# EAGLE design circuit (EAGLE 7.6.0)
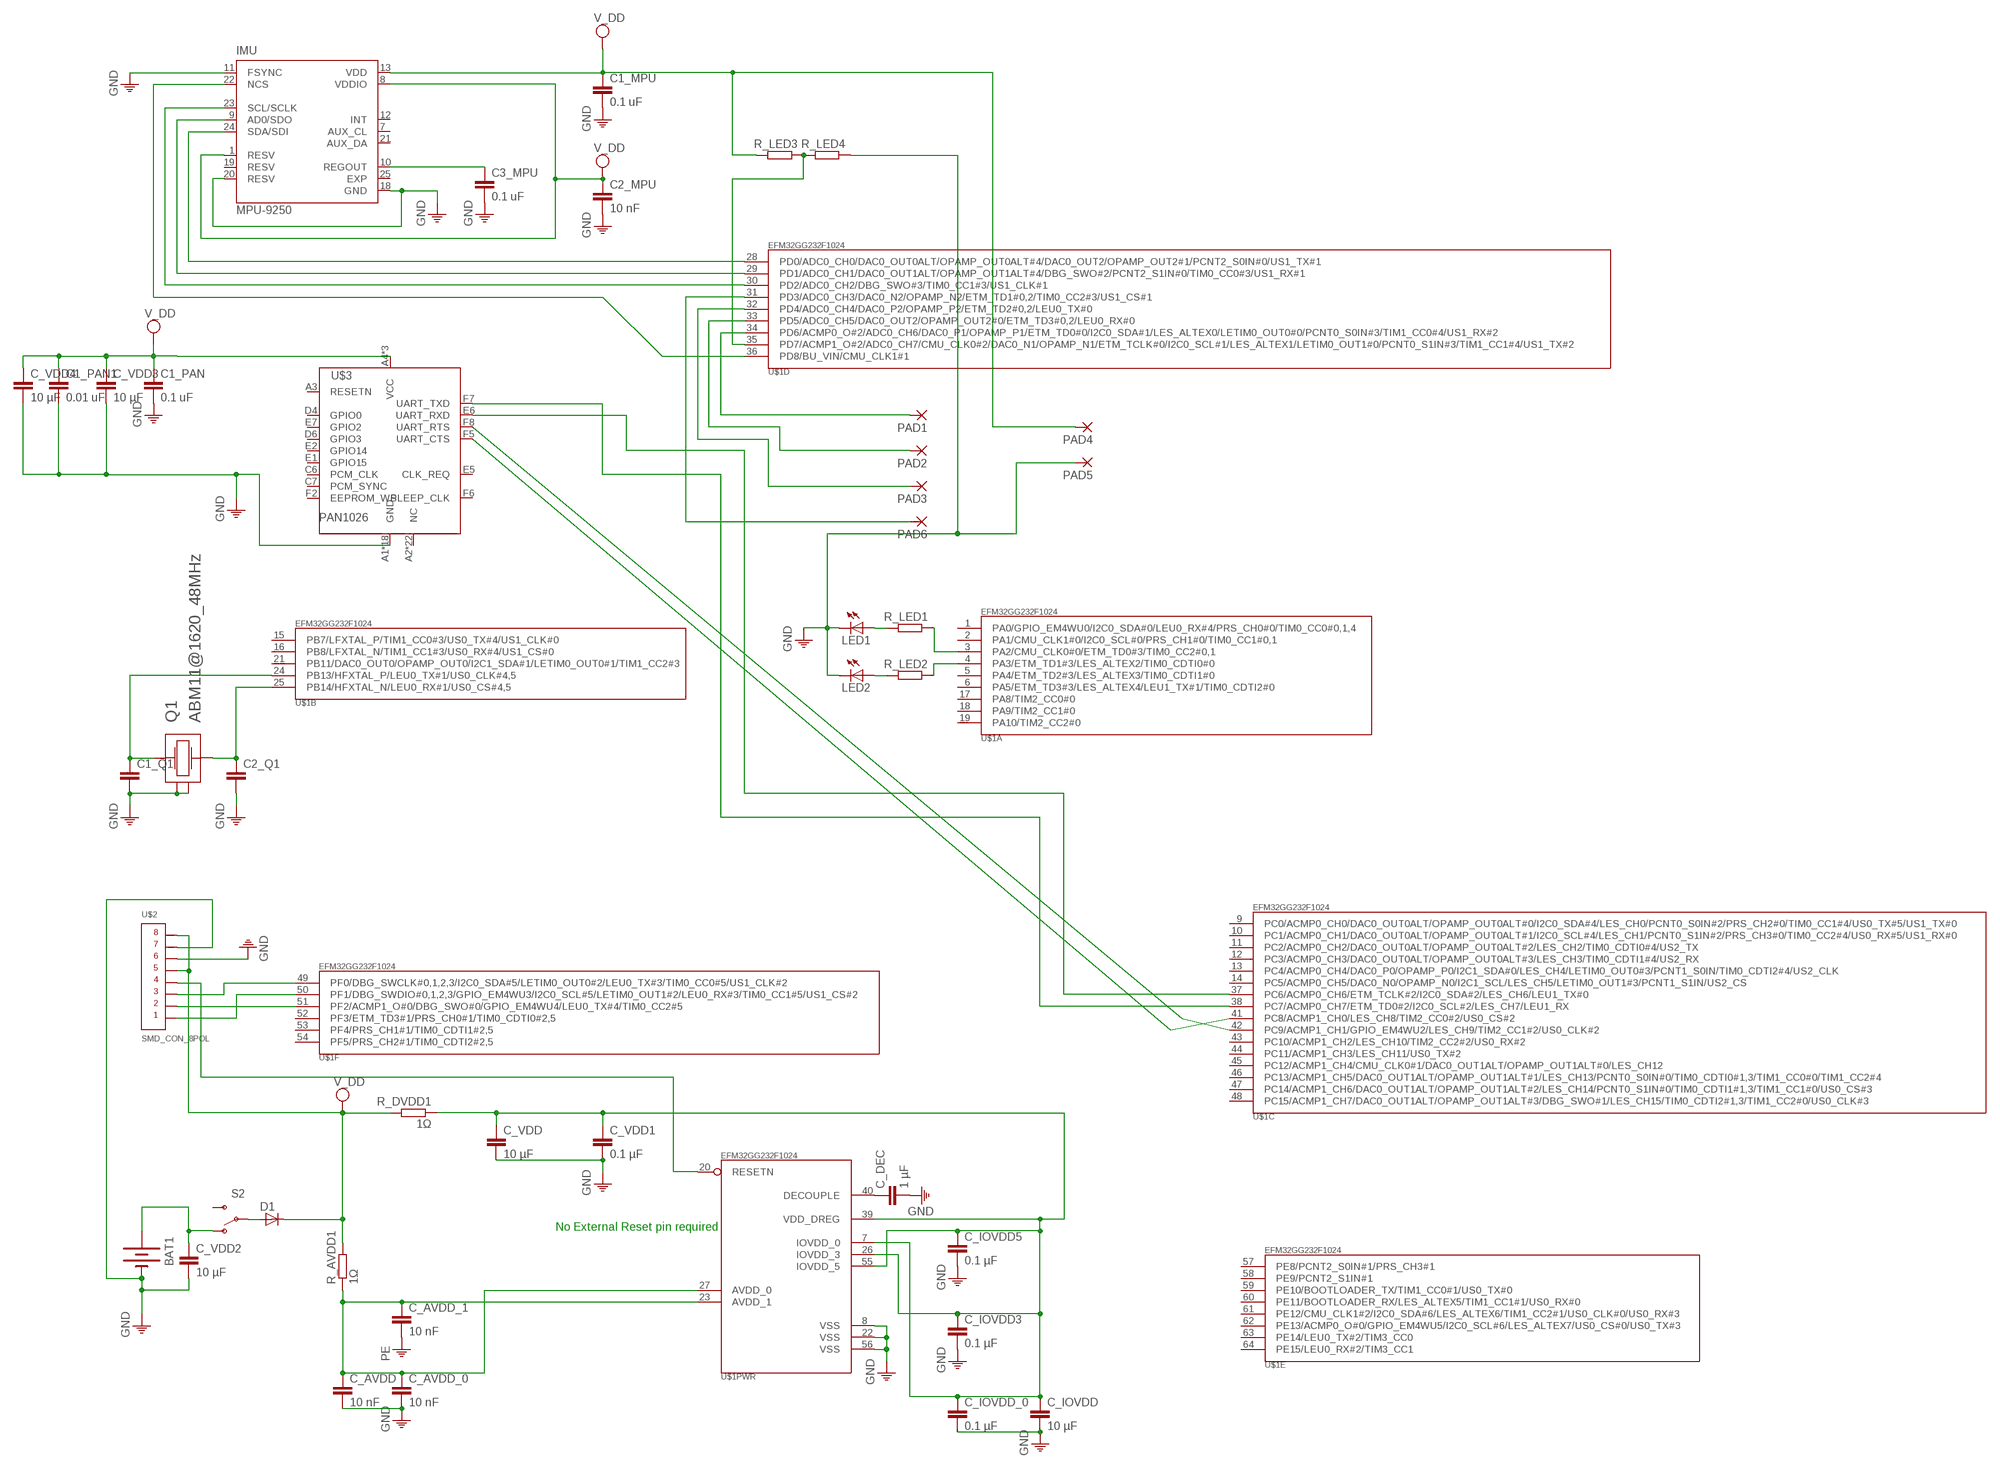
[diagram p0: schematic, sheet 1]

## Parts
BAT1  BATTERY20MM_4LEGS_OVERPASTE  [BATTCON_20MM_4LEGS_OVERPASTE]
C1_MPU  0.1 uF  C-EUC0603  [C0603]
C1_PAN  0.1 uF  C-EUC0603  [C0603]
C1_PAN1  0.01 uF  C-EUC0603  [C0603]
C1_Q1  C-EUC0603  [C0603]
C2_MPU  10 nF  C-EUC0603  [C0603]
C2_Q1  C-EUC0603  [C0603]
C3_MPU  0.1 uF  C-EUC0603  [C0603]
C_AVDD  10 nF  C-EUC0603  [C0603]
C_AVDD_0  10 nF  C-EUC0603  [C0603]
C_AVDD_1  10 nF  C-EUC0603  [C0603]
C_DEC  1 µF  C-EUC0603  [C0603]
C_IOVDD  10 µF  C-EUC0805  [C0805]
C_IOVDD3  0.1 µF  C-EUC0603  [C0603]
C_IOVDD5  0.1 µF  C-EUC0603  [C0603]
C_IOVDD_0  0.1 µF  C-EUC0603  [C0603]
C_VDD  10 µF  C-EUC0805  [C0805]
C_VDD1  0.1 µF  C-EUC0603  [C0603]
C_VDD2  10 µF  C-EUC0805  [C0805]
C_VDD3  10 µF  C-EUC0805  [C0805]
C_VDD4  10 µF  C-EUC0805  [C0805]
D1  D-SOD123  [SOD123]
IMU  MPU-9250  [QFN40P300X300X105-25N]
LED1  LEDCHIPLED_0805  [CHIPLED_0805]
LED2  LEDCHIPLED_0805  [CHIPLED_0805]
PAD1  SMD2  [SMD1,27-2,54]
PAD2  SMD2  [SMD1,27-2,54]
PAD3  SMD2  [SMD1,27-2,54]
PAD4  SMD2  [SMD1,27-2,54]
PAD5  SMD2  [SMD1,27-2,54]
PAD6  SMD2  [SMD1,27-2,54]
Q1  ABM11@1620_48MHz  ABM11@1620  [1620]
R_AVDD1  1Ω  R-EU_R0603  [R0603]
R_DVDD1  1Ω  R-EU_R0603  [R0603]
R_LED1  R-EU_R0603  [R0603]
R_LED2  R-EU_R0603  [R0603]
R_LED3  R-EU_R0603  [R0603]
R_LED4  R-EU_R0603  [R0603]
S2  SWITCH-SPDTSMD2  [SWITCH-SPDT-SMD]
U$1  EFM32GG232F1024  [QFP64]
U$2  SMD_CON_8POL  [SMD_CON_8POL]
U$3  PAN1026  [PAN1026]

## Nets
GND: BAT1.2(-) C1_MPU.2 C1_PAN1.2 C1_PAN.2 C1_Q1.2 C2_MPU.2 C2_Q1.2 C3_MPU.2 C_AVDD.2 C_AVDD_0.2 C_AVDD_1.2 C_DEC.2 C_IOVDD3.2 C_IOVDD5.2 C_IOVDD.2 C_IOVDD_0.2 C_VDD1.2 C_VDD2.2 C_VDD3.2 C_VDD4.2 C_VDD.2 IMU.11(FSYNC) IMU.18(GND) IMU.20(RESV) LED1.C LED2.C PAD5.1(P) Q1.P$2 Q1.P$4 R_LED4.1 U$1.8(PWR:VSS) U$1.22(PWR:VSS) U$1.56(PWR:VSS) U$2.P$6 U$2.P$7 U$3.A1(GND) U$3.A7(GND) U$3.A9(GND) U$3.A11(GND) U$3.A12(GND) U$3.C8(GND) U$3.C9(GND) U$3.D7(GND) U$3.D8(GND) U$3.E3(GND) U$3.E8(GND) U$3.E9(GND) U$3.F1(GND) U$3.F3(GND) U$3.F4(GND) U$3.F9(GND) U$3.F11(GND) U$3.F12(GND) ; supply symbol labelled PE
N$1: C_DEC.1 U$1.40(PWR:DECOUPLE)
N$2: C_IOVDD3.1 C_IOVDD5.1 C_IOVDD.1 C_IOVDD_0.1 C_VDD1.1 C_VDD.1 R_DVDD1.1 U$1.7(PWR:IOVDD_0) U$1.26(PWR:IOVDD_3) U$1.39(PWR:VDD_DREG) U$1.55(PWR:IOVDD_5)
N$3: PAD3.1(P) U$1.32(D:PD4/ADC0_CH4/DAC0_P2/OPAMP_P2/ETM_TD2#0,2/LEU0_TX#0)
N$4: C2_Q1.1 Q1.P$1 U$1.25(B:PB14/HFXTAL_N/LEU0_RX#1/US0_CS#4,5)
N$5: C_AVDD.1 C_AVDD_0.1 C_AVDD_1.1 R_AVDD1.1 U$1.23(PWR:AVDD_1) U$1.27(PWR:AVDD_0)
N$6: BAT1.1(+) C_VDD2.1 S2.1(O)
N$7: PAD2.1(P) U$1.33(D:PD5/ADC0_CH5/DAC0_OUT2/OPAMP_OUT2#0/ETM_TD3#0,2/LEU0_RX#0)
N$8: C1_Q1.1 Q1.P$3 U$1.24(B:PB13/HFXTAL_P/LEU0_TX#1/US0_CLK#4,5)
N$9: U$1.50(F:PF1/DBG_SWDIO#0,1,2,3/GPIO_EM4WU3/I2C0_SCL#5/LETIM0_OUT1#2/LEU0_RX#3/TIM0_CC1#5/US1_CS#2) U$2.P$1
N$10: U$1.51(F:PF2/ACMP1_O#0/DBG_SWO#0/GPIO_EM4WU4/LEU0_TX#4/TIM0_CC2#5) U$2.P$2
N$11: D1.2(A) S2.2(P)
N$12: U$1.20(PWR:RESETN) U$2.P$4
N$13: IMU.22(NCS) U$1.36(D:PD8/BU_VIN/CMU_CLK1#1)
N$14: IMU.23(SCL/SCLK) U$1.30(D:PD2/ADC0_CH2/DBG_SWO#3/TIM0_CC1#3/US1_CLK#1)
N$15: IMU.9(AD0/SDO) U$1.29(D:PD1/ADC0_CH1/DAC0_OUT1ALT/OPAMP_OUT1ALT#4/DBG_SWO#2/PCNT2_S1IN#0/TIM0_CC0#3/US1_RX#1)
N$16: IMU.24(SDA/SDI) U$1.28(D:PD0/ADC0_CH0/DAC0_OUT0ALT/OPAMP_OUT0ALT#4/DAC0_OUT2/OPAMP_OUT2#1/PCNT2_S0IN#0/US1_TX#1)
N$17: C3_MPU.1 IMU.10(REGOUT)
N$18: LED1.A R_LED1.2
N$19: LED2.A R_LED2.2
N$20: R_LED1.1 U$1.3(A:PA2/CMU_CLK0#0/ETM_TD0#3/TIM0_CC2#0,1)
N$21: R_LED2.1 U$1.4(A:PA3/ETM_TD1#3/LES_ALTEX2/TIM0_CDTI0#0)
N$22: PAD1.1(P) U$1.34(D:PD6/ACMP0_O#2/ADC0_CH6/DAC0_P1/OPAMP_P1/ETM_TD0#0/I2C0_SDA#1/LES_ALTEX0/LETIM0_OUT0#0/PCNT0_S0IN#3/TIM1_CC0#4/US1_RX#2)
N$23: PAD6.1(P) U$1.31(D:PD3/ADC0_CH3/DAC0_N2/OPAMP_N2/ETM_TD1#0,2/TIM0_CC2#3/US1_CS#1)
N$25: U$1.37(C:PC6/ACMP0_CH6/ETM_TCLK#2/I2C0_SDA#2/LES_CH6/LEU1_TX#0) U$3.E6(UART_RXD)
N$26: U$1.38(C:PC7/ACMP0_CH7/ETM_TD0#2/I2C0_SCL#2/LES_CH7/LEU1_RX) U$3.F7(UART_TXD)
N$27: U$1.49(F:PF0/DBG_SWCLK#0,1,2,3/I2C0_SDA#5/LETIM0_OUT0#2/LEU0_TX#3/TIM0_CC0#5/US1_CLK#2) U$2.P$3
N$28: R_LED3.1 R_LED4.2 U$1.35(D:PD7/ACMP1_O#2/ADC0_CH7/CMU_CLK0#2/DAC0_N1/OPAMP_N1/ETM_TCLK#0/I2C0_SCL#1/LES_ALTEX1/LETIM0_OUT1#0/PCNT0_S1IN#3/TIM1_CC1#4/US1_TX#2)
N$29: U$1.42(C:PC9/ACMP1_CH1/GPIO_EM4WU2/LES_CH9/TIM2_CC1#2/US0_CLK#2) U$3.F8(UART_RTS)
N$30: U$1.41(C:PC8/ACMP1_CH0/LES_CH8/TIM2_CC0#2/US0_CS#2) U$3.F5(UART_CTS)
VDD: C1_MPU.1 C1_PAN1.1 C1_PAN.1 C2_MPU.1 C_VDD3.1 C_VDD4.1 D1.1(C) IMU.1(RESV) IMU.8(VDDIO) IMU.13(VDD) PAD4.1(P) R_AVDD1.2 R_DVDD1.2 R_LED3.2 U$2.P$5 U$2.P$8 U$3.A4(VCC) U$3.A5(VCC) U$3.A6(VCC) ; supply symbol labelled V_DD
Unconnected: IMU.7(AUX_CL) IMU.12(INT) IMU.21(AUX_DA) S2.3(S) U$1.1(A:PA0/GPIO_EM4WU0/I2C0_SDA#0/LEU0_RX#4/PRS_CH0#0/TIM0_CC0#0,1,4) U$1.2(A:PA1/CMU_CLK1#0/I2C0_SCL#0/PRS_CH1#0/TIM0_CC1#0,1) U$1.5(A:PA4/ETM_TD2#3/LES_ALTEX3/TIM0_CDTI1#0) U$1.6(A:PA5/ETM_TD3#3/LES_ALTEX4/LEU1_TX#1/TIM0_CDTI2#0) U$1.9(C:PC0/ACMP0_CH0/DAC0_OUT0ALT/OPAMP_OUT0ALT#0/I2C0_SDA#4/LES_CH0/PCNT0_S0IN#2/PRS_CH2#0/TIM0_CC1#4/US0_TX#5/US1_TX#0) U$1.10(C:PC1/ACMP0_CH1/DAC0_OUT0ALT/OPAMP_OUT0ALT#1/I2C0_SCL#4/LES_CH1/PCNT0_S1IN#2/PRS_CH3#0/TIM0_CC2#4/US0_RX#5/US1_RX#0) U$1.11(C:PC2/ACMP0_CH2/DAC0_OUT0ALT/OPAMP_OUT0ALT#2/LES_CH2/TIM0_CDTI0#4/US2_TX) U$1.12(C:PC3/ACMP0_CH3/DAC0_OUT0ALT/OPAMP_OUT0ALT#3/LES_CH3/TIM0_CDTI1#4/US2_RX) U$1.13(C:PC4/ACMP0_CH4/DAC0_P0/OPAMP_P0/I2C1_SDA#0/LES_CH4/LETIM0_OUT0#3/PCNT1_S0IN/TIM0_CDTI2#4/US2_CLK) U$1.14(C:PC5/ACMP0_CH5/DAC0_N0/OPAMP_N0/I2C1_SCL/LES_CH5/LETIM0_OUT1#3/PCNT1_S1IN/US2_CS) U$1.15(B:PB7/LFXTAL_P/TIM1_CC0#3/US0_TX#4/US1_CLK#0) U$1.16(B:PB8/LFXTAL_N/TIM1_CC1#3/US0_RX#4/US1_CS#0) U$1.17(A:PA8/TIM2_CC0#0) U$1.18(A:PA9/TIM2_CC1#0) U$1.19(A:PA10/TIM2_CC2#0) U$1.21(B:PB11/DAC0_OUT0/OPAMP_OUT0/I2C1_SDA#1/LETIM0_OUT0#1/TIM1_CC2#3) U$1.43(C:PC10/ACMP1_CH2/LES_CH10/TIM2_CC2#2/US0_RX#2) U$1.44(C:PC11/ACMP1_CH3/LES_CH11/US0_TX#2) U$1.45(C:PC12/ACMP1_CH4/CMU_CLK0#1/DAC0_OUT1ALT/OPAMP_OUT1ALT#0/LES_CH12) U$1.46(C:PC13/ACMP1_CH5/DAC0_OUT1ALT/OPAMP_OUT1ALT#1/LES_CH13/PCNT0_S0IN#0/TIM0_CDTI0#1,3/TIM1_CC0#0/TIM1_CC2#4) U$1.47(C:PC14/ACMP1_CH6/DAC0_OUT1ALT/OPAMP_OUT1ALT#2/LES_CH14/PCNT0_S1IN#0/TIM0_CDTI1#1,3/TIM1_CC1#0/US0_CS#3) U$1.48(C:PC15/ACMP1_CH7/DAC0_OUT1ALT/OPAMP_OUT1ALT#3/DBG_SWO#1/LES_CH15/TIM0_CDTI2#1,3/TIM1_CC2#0/US0_CLK#3) U$1.52(F:PF3/ETM_TD3#1/PRS_CH0#1/TIM0_CDTI0#2,5) U$1.53(F:PF4/PRS_CH1#1/TIM0_CDTI1#2,5) U$1.54(F:PF5/PRS_CH2#1/TIM0_CDTI2#2,5) U$1.57(E:PE8/PCNT2_S0IN#1/PRS_CH3#1) U$1.58(E:PE9/PCNT2_S1IN#1) U$1.59(E:PE10/BOOTLOADER_TX/TIM1_CC0#1/US0_TX#0) U$1.60(E:PE11/BOOTLOADER_RX/LES_ALTEX5/TIM1_CC1#1/US0_RX#0) U$1.61(E:PE12/CMU_CLK1#2/I2C0_SDA#6/LES_ALTEX6/TIM1_CC2#1/US0_CLK#0/US0_RX#3) U$1.62(E:PE13/ACMP0_O#0/GPIO_EM4WU5/I2C0_SCL#6/LES_ALTEX7/US0_CS#0/US0_TX#3) U$1.63(E:PE14/LEU0_TX#2/TIM3_CC0) U$1.64(E:PE15/LEU0_RX#2/TIM3_CC1) U$3.A2(NC) U$3.A3(RESETN) U$3.A8(NC) U$3.B1(NC) U$3.B2(NC) U$3.B3(NC) U$3.B4(NC) U$3.B5(NC) U$3.B6(NC) U$3.B7(NC) U$3.B8(NC) U$3.B9(NC) U$3.C1(NC) U$3.C2(NC) U$3.C3(NC) U$3.C4(NC) U$3.C5(NC) U$3.C6(PCM_CLK) U$3.C7(PCM_SYNC) U$3.D1(NC) U$3.D2(NC) U$3.D3(NC) U$3.D4(GPIO0) U$3.D5(NC) U$3.D6(GPIO3) U$3.D9(NC) U$3.E1(GPIO15) U$3.E2(GPIO14) U$3.E4(NC) U$3.E5(CLK_REQ) U$3.E7(GPIO2) U$3.F2(EEPROM_WP) U$3.F6(SLEEP_CLK)

## Notes on the sheet
- No External Reset pin required

## Power pins joined to a net without a drawn wire
EXP: IMU.25(EXP)
RESV: IMU.19(RESV)

## Library data of the parts
BAT1 = SparkFun-Electromechanical:BATTERY: Battery Holders Various common sizes : AA, AAA, 18650 (PRT-12895), 20mm coin cell and 12mm coin cell. 20MM_4LEGS, BATT-10373
C1_MPU C1_PAN C1_PAN1 C1_Q1 C2_MPU C2_Q1 C3_MPU C_AVDD C_AVDD_0 C_AVDD_1 C_DEC C_IOVDD C_IOVDD3 C_IOVDD5 C_IOVDD_0 C_VDD C_VDD1-C_VDD4 = rcl:C-EU: CAPACITOR, European symbol; OC_FARNELL: unknown
D1 = semicon-smd-ipc:D-: DIODE unfilled
IMU = MPU-9250:MPU-9250: GYRO/ACCEL/COMPASS/9-AXIS; OC_FARNELL: unknown
LED1 LED2 = led:LED: LED OSRAM: - CHIPLED LG R971, LG N971, LY N971, LG Q971, LY Q971, LO R971, LY R971 LH N974, LH R974 LS Q976, LO Q976, LY Q976 LO Q996 - Hyper CHIPLED LW Q18S LB Q993, LB Q99A, LB R99A - SideLED LS A670, LO A670, LY A670, LG A670, LP A670 LB A673, LV A673, LT A673, LW A673 LH A674 LY A675 LS A676, LA A676, LO A676, LY A676, LW A676 LS A679, LY A679, LG A679 - Hyper Micro SIDELED® LS Y876, LA Y876, LO Y876, LY Y876 LT Y87S - SmartLED LW L88C, LW L88S LB L89C, LB L89S, LG L890 LS L89K, LO L89K, LY L89K LS L896, LA L896, LO L896, LY L896 - TOPLED LS T670, LO T670, LY T670, LG T670, LP T670 LSG T670, LSP T670, LSY T670, LOP T670, LYG T670 LG T671, LOG T671, LSG T671 LB T673, LV T673, LT T673, LW T673 LH T674 LS T676, LA T676, LO T676, LY T676, LB T676, LH T676, LSB T676, LW T676 LB T67C, LV T67C, LT T67C, LS T67K, LO T67K, LY T67K, LW E67C LS E67B, LA E67B, LO E67B, LY E67B, LB E67C, LV E67C, LT E67C LW T67C LS T679, LY T679, LG T679 LS T770, LO T770, LY T770, LG T770, LP T770 LB T773, LV T773, LT T773, LW T773 LH T774 LS E675, LA E675, LY E675, LS T675 LS T776, LA T776, LO T776, LY T776, LB T776 LHGB T686 LT T68C, LB T68C - Hyper Mini TOPLED® LB M676 - Mini TOPLED Santana® LG M470 LS M47K, LO M47K, LY M47K Source: http://www.osram.convergy.de LUXEON: - LUMILED® LXK2-PW12-R00, LXK2-PW12-S00, LXK2-PW14-U00, LXK2-PW14-V00 LXK2-PM12-R00, LXK2-PM12-S00, LXK2-PM14-U00 LXK2-PE12-Q00, LXK2-PE12-R00, LXK2-PE12-S00, LXK2-PE14-T00, LXK2-PE14-U00 LXK2-PB12-K00, LXK2-PB12-L00, LXK2-PB12-M00, LXK2-PB14-N00, LXK2-PB14-P00, LXK2-PB14-Q00 LXK2-PR12-L00, LXK2-PR12-M00, LXK2-PR14-Q00, LXK2-PR14-R00 LXK2-PD12-Q00, LXK2-PD12-R00, LXK2-PD12-S00 LXK2-PH12-R00, LXK2-PH12-S00 LXK2-PL12-P00, LXK2-PL12-Q00, LXK2-PL12-R00 Source: www.luxeon.com KINGBRIGHT: KA-3528ASYC Source: www.kingbright.com; OC_FARNELL: unknown
PAD1-PAD6 = wirepad:SMD2: SMD PAD
Q1 = crystals:ABM11
R_AVDD1 R_DVDD1 R_LED1-R_LED4 = rcl:R-EU_: RESISTOR, European symbol; OC_FARNELL: unknown
S2 = SparkFun-Electromechanical:SWITCH-SPDT: SPDT Switch Simple slide switch, Spark Fun Electronics SKU : COM-00102 DPDT SMT slide switch, AYZ0202, SWCH-08179
U$1 = EnergyMicro:EFM32GG232F1024: EFM32GG232F1024 Gecko Microcontroller in 10mm x 10mm QFP64 package; OC_FARNELL: unknown
U$2 = con-microsmd:SMD_CON_8POL
U$3 = asl_bluetooth_module:PAN1026

## Board
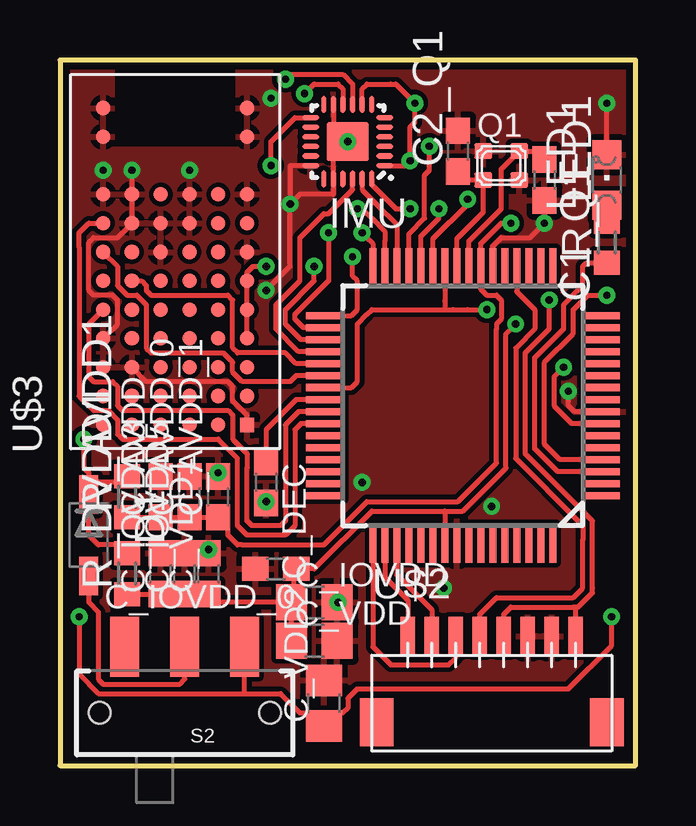
[diagram p1: board, top side]
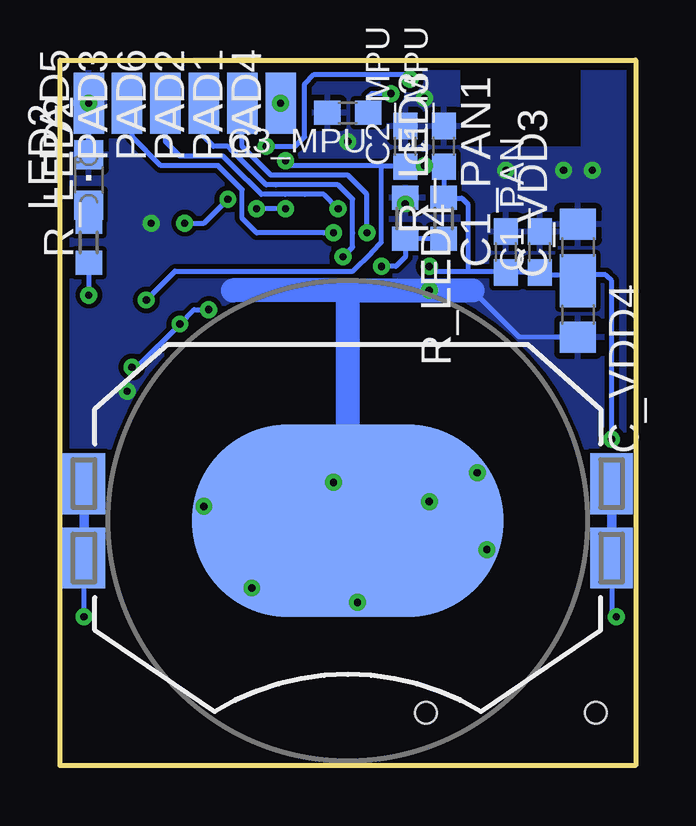
[diagram p2: board, bottom side, seen from below]

Size 24 x 29.4 mm. Coordinates in mm from the lower left corner, seen from the top.
Outline: 0,0 24,0 24,29.4 0,29.4 0,0
Copper layers (1*16): Top 0.035mm / dielectric 1.5mm / Bottom 0.035mm
Design rules "default *": minimum track width 0.2mm, minimum drill 0.3mm, track to track 0.2mm, track to pad 0.2mm, pad to pad 0.2mm, via to via 0.2mm, smd to smd 0mil, copper to edge 0.3mm, drill to drill 0.5mm, minimum pad ring 10mil, minimum via ring 8mil, stop-mask expansion 4mil, vias tented up to drill 0mil, thermal gap 10mil
tKeepout: area 2.3,25.8 to 7.3,28.8; area 2.3,26.2 to 7.3,29.2
bKeepout: area 2.3,25.8 to 7.3,28.8; area 2.3,26.2 to 7.3,29.2
tRestrict: area 2.3,25.8 to 7.3,28.8; area 2.3,26.2 to 7.3,29.2
bRestrict: area 2.3,26.2 to 7.3,29.2; area 2.3,25.8 to 7.3,28.8

### Footprints (pad centres in the part's own frame; a part is rotated, then mirrored left to right if it is on the bottom)
BATTCON_20MM_4LEGS_OVERPASTE = smd 1.778 x 2.54: 1 -11,1.55; 3 11,1.55; P$1 -11,-1.55; P$2 11,-1.55 | smd 13 x 8: 2 0,0
C0603 = smd 1.1 x 1: 1 -0.85,0; 2 0.85,0
C0805 = smd 1.3 x 1.5: 1 -0.95,0; 2 0.95,0
SOD123 = smd 1.6 x 0.8: 1 -1.7,0; 2 1.7,0
QFN40P300X300X105-25N = smd 0.7 x 0.2: 1 -1.55,1; 2 -1.55,0.6; 3 -1.55,0.2; 4 -1.55,-0.2; 5 -1.55,-0.6; 6 -1.55,-1; 13 1.55,-1; 14 1.55,-0.6; 15 1.55,-0.2; 16 1.55,0.2; 17 1.55,0.6; 18 1.55,1 | smd 0.2 x 0.7: 7 -1,-1.55; 8 -0.6,-1.55; 9 -0.2,-1.55; 10 0.2,-1.55; 11 0.6,-1.55; 12 1,-1.55; 19 1,1.55; 20 0.6,1.55; 21 0.2,1.55; 22 -0.2,1.55; 23 -0.6,1.55; 24 -1,1.55 | smd 1.75 x 1.6: 25 0,0
CHIPLED_0805 = smd 1.2 x 1.2: A 0,-1.05; C 0,1.05
SMD1,27-2,54 = smd 1.27 x 2.54: 1 0,0
1620 = smd 0.75 x 0.65: P$1 -0.75,-0.6; P$2 0.75,-0.6; P$3 0.75,0.6; P$4 -0.75,0.6
R0603 = smd 1 x 1.1: 1 -0.85,0; 2 0.85,0
SWITCH-SPDT-SMD = smd 1.2 x 2.5: 1 -2.5,-2.75; 2 0,-2.75; 3 2.5,-2.75 | hole 0.9: -3.55,0; 3.55,0
QFP64 = smd 1.6 x 0.3: 1 -5.75,3.75; 2 -5.75,3.25; 3 -5.75,2.75; 4 -5.75,2.25; 5 -5.75,1.75; 6 -5.75,1.25; 7 -5.75,0.75; 8 -5.75,0.25; 9 -5.75,-0.25; 10 -5.75,-0.75; 11 -5.75,-1.25; 12 -5.75,-1.75; 13 -5.75,-2.25; 14 -5.75,-2.75; 15 -5.75,-3.25; 16 -5.75,-3.75; 33 5.75,-3.75; 34 5.75,-3.25; 35 5.75,-2.75; 36 5.75,-2.25; 37 5.75,-1.75; 38 5.75,-1.25; 39 5.75,-0.75; 40 5.75,-0.25; 41 5.75,0.25; 42 5.75,0.75; 43 5.75,1.25; 44 5.75,1.75; 45 5.75,2.25; 46 5.75,2.75; 47 5.75,3.25; 48 5.75,3.75 | smd 0.3 x 1.6: 17 -3.75,-5.75; 18 -3.25,-5.75; 19 -2.75,-5.75; 20 -2.25,-5.75; 21 -1.75,-5.75; 22 -1.25,-5.75; 23 -0.75,-5.75; 24 -0.25,-5.75; 25 0.25,-5.75; 26 0.75,-5.75; 27 1.25,-5.75; 28 1.75,-5.75; 29 2.25,-5.75; 30 2.75,-5.75; 31 3.25,-5.75; 32 3.75,-5.75; 49 3.75,5.75; 50 3.25,5.75; 51 2.75,5.75; 52 2.25,5.75; 53 1.75,5.75; 54 1.25,5.75; 55 0.75,5.75; 56 0.25,5.75; 57 -0.25,5.75; 58 -0.75,5.75; 59 -1.25,5.75; 60 -1.75,5.75; 61 -2.25,5.75; 62 -2.75,5.75; 63 -3.25,5.75; 64 -3.75,5.75
SMD_CON_8POL = smd 0.6 x 1.6: P$1 1.5,4.8; P$2 2.5,4.8; P$3 3.5,4.8; P$4 4.5,4.8; P$5 5.5,4.8; P$6 6.5,4.8; P$7 7.5,4.8; P$8 8.5,4.8 | smd 1.4 x 2: P$9 0.2,1.2; P$10 9.8,1.2
PAN1026 = smd 0.6 x 0.6: A1 -6.8,-3; A2 -5.6,-3; A3 -4.4,-3; A4 -3.2,-3; A5 -2,-3; A6 -0.8,-3; A7 0.4,-3; A8 1.6,-3; A9 2.8,-3; A11 5.2,-3; A12 6.4,-3; B1 -6.8,-1.8; B2 -5.6,-1.8; B3 -4.4,-1.8; B4 -3.2,-1.8; B5 -2,-1.8; B6 -0.8,-1.8; B7 0.4,-1.8; B8 1.6,-1.8; B9 2.8,-1.8; C1 -6.8,-0.6; C2 -5.6,-0.6; C3 -4.4,-0.6; C4 -3.2,-0.6; C5 -2,-0.6; C6 -0.8,-0.6; C7 0.4,-0.6; C8 1.6,-0.6; C9 2.8,-0.6; D1 -6.8,0.6; D2 -5.6,0.6; D3 -4.4,0.6; D4 -3.2,0.6; D5 -2,0.6; D6 -0.8,0.6; D7 0.4,0.6; D8 1.6,0.6; D9 2.8,0.6; E1 -6.8,1.8; E2 -5.6,1.8; E3 -4.4,1.8; E4 -3.2,1.8; E5 -2,1.8; E6 -0.8,1.8; E7 0.4,1.8; E8 1.6,1.8; E9 2.8,1.8; F1 -6.8,3; F2 -5.6,3; F3 -4.4,3; F4 -3.2,3; F5 -2,3; F6 -0.8,3; F7 0.4,3; F8 1.6,3; F9 2.8,3; F11 5.2,3; F12 6.4,3

### Placement (x,y rotation side)
BAT1  12,10.2 0 bottom
C1_MPU  8,25.8 90 bottom
C1_PAN  4,21.4 90 bottom
C1_PAN1  5.4,21.4 90 bottom
C1_Q1  20.2,24.4 270 top
C2_MPU  9.6,25.8 90 bottom
C2_Q1  16.6,25.6 90 top
C3_MPU  12,27.2 180 bottom
C_AVDD  4.2,11.2 90 top
C_AVDD_0  5.4,11.2 90 top
C_AVDD_1  6.6,11.2 90 top
C_DEC  8.6,11.8 270 top
C_IOVDD  10.6,6.8 0 top
C_IOVDD3  4.2,8 90 top
C_IOVDD5  5.2,8 90 top
C_IOVDD_0  9,8.2 180 top
C_VDD  10.6,5.2 0 top
C_VDD1  6.2,8 90 top
C_VDD2  11,2.6 90 top
C_VDD3  2.4,21.6 90 bottom
C_VDD4  2.4,18.8 270 bottom
D1  1.2,9.6 270 top
IMU  12,26 180 top
LED1  22.8,24.4 0 top
LED2  22.8,24.4 0 bottom
PAD1  16.4,27.6 0 bottom
PAD2  18,27.6 0 bottom
PAD3  21.2,27.6 0 bottom
PAD4  14.8,27.6 0 bottom
PAD5  22.8,27.6 0 bottom
PAD6  19.6,27.6 0 bottom
Q1  18.4,25 0 top
R_AVDD1  2.8,11.2 90 top
R_DVDD1  2.8,8 90 top
R_LED1  22.8,21.8 90 top
R_LED2  22.8,21.8 90 bottom
R_LED3  8,22.8 90 bottom
R_LED4  9.6,22.8 270 bottom
S2  5.2,2.2 180 top
U$1  16.8,15 180 top
U$2  13,0.6 0 top
U$3  4.8,21 90 top

### Tracks (layer width: path | path; a pad name or v marks a point on that pad's centre or on a via)
GND  (via drill 0.3)
  Top 0.2: IMU.18 9.6,25 R_LED4.1 v9.6,23.4 | LED2.C PAD5.1 | U$1.22 18.05,21.65 18.4,22 19.6,22 v20.2,22.6 C1_Q1.2 | U$1.8 21.45,14.75 21.2,15 21.2,15.2 v21.2,15.6 | IMU.11 11.4,26.6 v12,26 11.4,25.4 IMU.20 11.4,24 11.4,23.8 10,23.8 v9.6,23.4 | U$3.A1 7.8,14.6 7.2,15.2 7.2,15.8 7,16 3.6,16 U$3.E3 | U$3.F4 2.4,18.4 | 2.4,18.4 2.4,19.2 | 2.4,19.2 2.4,19.4 | 2.4,19.4 2.2,19.6 | 2.2,19.6 1.4,19.6 | 1.4,19.6 1.2,19.8 | 1.2,19.8 1.2,21.8 | 1.2,21.8 1.4,22 | 1.4,22 2.4,22 | 2.4,22 U$3.E8 | 2.4,18.4 2.4,19.2 | v8.6,19.8 9.6,20.8 v9.6,23.4 | 2.4,18.4 2.4,19.4 | 2.4,19.4 2.2,19.6 | 2.2,19.6 1.4,19.6 | 1.4,19.6 1.2,19.8 | 1.2,19.8 1.2,21.8 | 1.2,21.8 1.4,22 | 1.4,22 2.4,22 | 2.4,22 U$3.E8 | U$3.E8 v3,24.8
  Bottom 0.2: LED2.C PAD5.1 | v16,7.4 BAT1.2 v12.6,11.8 | v12.6,11.8 v11.6,6.8 | v8.6,11 v6.2,9 | v8.6,11 v12.6,11.8 | v6.6,12.2 v8.6,11 | C_VDD4.2 4.85,17.85 6.8,19.8 v8.6,19.8
  Bottom 1: 12.2,19.8 12,19.8 v8.6,19.8 6.8,19.8 | 12.2,19.8 16.8,19.8 | BAT1.2 12,19.6 arc-90 12.2,19.8
  other vias: 5.4,24.8 1.8,24.8 8.8,27.8 22.8,27.6 18,10.8
  pour Top: 0,29.4 0,0 24,0 24,29.4
  pour Bottom: 0,0 1.6,0 1.6,10.2 arc-90 12,20.6 arc-90 22.4,10.2 22.6,0 24,0 24,29.4 0,29.4
N$1
  Top 0.2: U$1.40 9.85,15.25 8.6,14 C_DEC.1
N$2  (via drill 0.3)
  Top 0.2: R_DVDD1.1 C_IOVDD3.1 C_IOVDD5.1 C_VDD1.1 arc61 6,6.8 C_IOVDD.1 | C_VDD.1 C_IOVDD.1 | 16.05,10.6 13,10.6 10.6,8.2 C_IOVDD_0.1 9.75,8.2 9.75,6.9 arc-90 C_IOVDD.1 | U$1.7 21.35,14.25 20.6,15 20.6,16.2 v21,16.6 | U$1.26 16.05,19.35 16.05,19 16,19 | 16.05,10.6 16.8,10.6 18.6,12.4 18.6,18 v19,18.4 | 16.05,10.6 U$1.55 | v17.8,19 17,19 16.4,19 16,19 | U$1.39 12.15,15.75 12.4,16 12.4,18.4 12.8,18.8 13,19 16,19
  Bottom 0.2: v17.8,19 18.4,19 v19,18.4 20.8,16.6 v21,16.6
N$3  (via drill 0.3)
  Top 0.2: v12.6,22.2 12.8,22 13,21.8 13.05,21.75 U$1.32
  Bottom 0.2: PAD3.1 21,26.2 19.8,25 17.4,25 16.4,24 16.4,22.8 15.8,22.2 13,22.2 v12.6,22.2
N$4
  Top 0.2: U$1.25 16.55,21.95 17.4,22.8 17.65,23.05 Q1.P$1 16.85,24.4 C2_Q1.1
N$5  (via drill 0.3)
  Top 0.2: R_AVDD1.1 C_AVDD.1 C_AVDD_0.1 C_AVDD_1.1 | U$1.27 15.55,21.95 17,23.4 v17,23.6 | v18.8,22.6 18.4,22.6 17.8,22 17.55,21.75 U$1.23 17.55,19.85 17.8,19.6 18.2,19.6 18.4,19.4 18.4,18.6 18.2,18.4 18.2,18.2 18.2,12.6 16.6,11 12.8,11 11,9.2 7.6,9.2 7.4,9.2 7,9.6 7,10 6.65,10.35 C_AVDD_1.1 | 6.75,10.4 C_AVDD_1.1
  Bottom 0.2: v18.8,22.6 18,22.6 v17,23.6
N$6  (via drill 0.3)
  Top 0.2: 11,2.2 C_VDD2.1 | v0.8,6.2 0.8,3.8 1.6,3 7.7,3 | 7.7,3 S2.1 | v23,6.2 23,5 21.2,3.2 13.6,3.2 12.4,3.2 12,2.8 12,2.4 11.8,2.2 11,2.2 | 7.7,3 9.2,3 10,2.2 11,2.2
  Bottom 0.2: v23,6.2 23,8.2 BAT1.1 | 1,8.4 1,6.4 v0.8,6.2
  Bottom 0.4: 23,8.2 BAT1.1 | 1,8.4 1,11.95
N$7  (via drill 0.3)
  Top 0.2: v12.2,21.2 12.2,20.4 12.4,20.2 12.4,19 12.15,18.75 U$1.33
  Bottom 0.2: v12.2,21.2 11.8,21.6 11.8,22.2 11.8,23.6 12.4,24.2 15,24.2 15.4,24.2 16.4,25.2 16.8,25.6 17,25.8 17.6,25.8 18,26.2 PAD2.1
N$8
  Top 0.2: U$1.24 17.05,21.85 18,22.8 18.4,23.2 18.4,24.8 18.4,24.85 Q1.P$3 19.95,25.6 C1_Q1.1
N$9
  Top 0.2: U$1.50 13.55,7.85 14.4,7 14.5,6.9 U$2.P$1
N$10
  Top 0.2: U$1.51 14.05,7.95 15.4,6.6 15.5,6.5 U$2.P$2
N$11
  Top 0.2: D1.2 1.2,6.8 1.6,6.4 1.6,3.6 1.8,3.4 5,3.4 5.2,3.6 S2.2
N$12
  Top 0.2: U$1.20 19.05,19.75 19.2,19.6 19.8,19 19.8,18.2 19,17.4 19,12.8 21.6,10.2 21.8,10 21.8,9.4 21.8,7.4 21.4,7 18.2,7 17.5,6.3 U$2.P$4
N$13
  Top 0.2: U$1.36 9.95,17.25 9,18.2 9,19 9,19.2 9.4,19.6 10,20.2 10,22 11,23 11.2,23 11.6,23.4 12.2,24 IMU.22
N$14
  Top 0.2: IMU.23 12.6,24 13.2,23.4 14.05,22.55 U$1.30
N$15  (via drill 0.3)
  Top 0.2: v9.4,28.6 9.6,28.8 11.8,28.8 12.2,28.4 IMU.9 | U$1.29 14.55,22.15 15.2,22.8 15.2,24.6 15.4,24.8 v15.4,25.8
  Bottom 0.2: v9.4,28.6 9.6,28.8 13.4,28.8 13.8,28.4 13.8,26.2 14.2,25.8 v15.4,25.8
N$16  (via drill 0.3)
  Top 0.2: IMU.24 13,24.2 14,23.2 v14.6,23.2 | U$1.28 15.05,22.05 15.8,22.8 v15.8,23.2
  Bottom 0.2: v14.6,23.2 v15.8,23.2
N$17  (via drill 0.3)
  Top 0.2: v10.2,28 10.6,28.4 11.6,28.4 11.8,28.2 IMU.10
  Bottom 0.2: v10.2,28 11,28 11.15,27.85 C3_MPU.1
N$18
  Top 0.2: LED1.A R_LED1.2
N$19
  Bottom 0.2: LED2.A R_LED2.2
N$20
  Top 0.2: U$1.3 20.75,12.25 19.8,13.2 19.8,14.4 19.8,17 21,18.2 21,19.2 21.6,19.8 21.8,20 21.8,20.4 21.8,20.6 21.8,20.8 21.95,20.95 R_LED1.1
N$21  (via drill 0.3)
  Top 0.2: U$1.4 20.85,12.75 20.2,13.4 20.2,16.8 21.4,18 21.4,19 21.8,19.4 22,19.6 v22.8,19.6
  Bottom 0.2: R_LED2.1 v22.8,19.6
N$22  (via drill 0.3)
  Top 0.2: U$1.34 10.15,18.25 9.8,18.6 9.8,18.8 10.6,19.6 11.2,20.2 11.2,20.6 11.2,22 v11.2,22.2
  Bottom 0.2: PAD1.1 16.4,27 16.4,25.8 15.2,24.6 12,24.6 11.2,23.8 v11.2,22.2
N$23  (via drill 0.3)
  Top 0.2: U$1.31 13.55,21.85 13.55,22.25 13,22.8 12.6,23.2 v12.4,23.2
  Bottom 0.2: v12.4,23.2 13,23.8 13.8,23.8 14.6,23.8 15.6,23.8 16.8,25 17.2,25.4 19,25.4 19.6,26 PAD6.1
N$25
  Top 0.2: U$1.37 9.85,16.75 9.4,17.2 7.4,17.2 7.2,17.4 7.2,19.4 7,19.6 3.8,19.6 3.6,19.8 3.6,20 3.4,20.2 U$3.E6
N$26
  Top 0.2: U$1.38 9.85,16.25 9.6,16 7.6,16 7.2,16.4 7.2,16.8 6.8,17.2 3.8,17.2 3.6,17.4 3.6,18 3.6,19.2 3.2,19.6 2.8,19.6 2.4,20 2.4,20.8 U$3.F7
N$27
  Top 0.2: U$1.49 13.05,4.95 13.8,4.2 16.2,4.2 16.5,4.5 U$2.P$3
N$28  (via drill 0.3)
  Top 0.2: U$1.35 10.05,17.75 9.4,18.4 9.4,19 10.6,20.2 v10.6,20.8
  Bottom 0.2: R_LED3.1 R_LED4.2 9.6,21.2 10,20.8 v10.6,20.8
N$29
  Top 0.2: U$1.42 10.05,14.25 9.8,14 9.8,10 9.4,9.6 7.8,9.6 7.4,10 7.4,12.8 6.6,13.6 4,13.6 2.6,13.6 2.4,13.8 2.4,14.4 2,14.8 1.8,14.8 1.4,14.8 0.8,15.4 0.8,21.6 0.8,22.2 1.2,22.6 U$3.F8
N$30
  Top 0.2: U$3.F5 1.2,18.4 1.2,16.4 1.2,16.2 1.4,16 2.2,16 2.4,15.8 2.4,15 2.6,14.8 3.6,14.8 7,14.8 7.2,14.6 7.2,13.6 7.6,13.2 7.8,13 7.8,12.4 7.8,10.2 8,10 9.2,10 9.4,10.2 9.4,14.2 9.95,14.75 U$1.41
VDD  (via drill 0.3)
  Top 0.2: 1.2,11.8 1.2,12.2 1,12.4 1,13.4 | 1.2,11.8 D1.1 1.2,9.6 1.6,9.2 2.45,9.2 R_DVDD1.2 | R_AVDD1.2 2.8,11.8 1.2,11.8 | v8.8,25 8.8,26 9.8,27 IMU.13 | IMU.8 12.6,28.2 12.8,28.4 13.8,28.4 14,28.4 PAD4.1 14.8,26.8 14.6,26.6 v14.6,25.2 14.4,25 IMU.1 | v20.4,19.4 20.4,18.2 19.6,17.4 19.4,17.2 19.4,13 21.6,10.8 22.2,10.2 22.2,7.4 22.2,7.2 21.6,6.6 21.4,6.6 | U$2.P$5 18.5,6.3 18.8,6.6 21.4,6.6 | U$2.P$8 21.5,6.6 21.4,6.6 | 1,13.4 v1,13.6 | v1,13.6 1,13.4 | 1,13.4 v1,13.6 | U$3.A4 U$3.A5 U$3.A6 7.8,20.55 8.05,20.8 v8.6,20.8
  Bottom 0.2: 2.55,20.2 arc90 C_VDD3.1 | C_VDD4.1 2.4,20.45 | 2.4,20.45 C_VDD3.1 | 2.4,20.45 3.5,20.45 arc90 C1_PAN.1 C1_PAN1.1 arc-90 5.45,20.6 7,20.6 | 2.4,20.45 2.6,20.45 C_VDD3.1 | C1_MPU.1 8,25 | C1_MPU.1 R_LED3.2 7.25,23.65 7,23.4 7,20.6 | 10.6,25 9.65,25 arc90 C2_MPU.1 9.55,25 v8.8,25 8.05,25 arc90 C1_MPU.1 | v20.4,19.4 19.2,20.6 11.8,20.6 11,21.4 10.6,21.8 10.6,25 | v1,13.6 1,20.2 1.2,20.4 1.25,20.45 2.4,20.45 | v8.6,20.8 8.4,20.6 7,20.6 | 10.6,25 14.4,25 v14.6,25.2
  other vias: 14.8,27.6